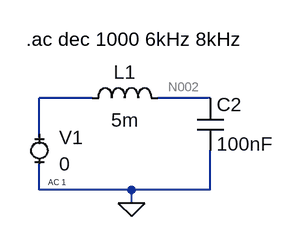
[diagram p0: schematic Draft1.asc]
Draft1.asc, the LTspice schematic file:
Version 4
SHEET 1 880 680
WIRE 144 96 80 96
WIRE 288 96 224 96
WIRE 80 144 80 96
WIRE 80 208 80 176
WIRE 192 208 80 208
WIRE 288 208 288 160
WIRE 288 208 192 208
WIRE 192 224 192 208
FLAG 192 224 0
SYMBOL MiniSyms4\\voltage- 80 160 R0
WINDOW 123 11 39 Left 0
WINDOW 39 0 0 Left 0
SYMATTR Value2 AC 1
SYMATTR InstName V1
SYMATTR Value 0
SYMBOL ind 128 112 R270
WINDOW 0 32 56 VTop 2
WINDOW 3 5 56 VBottom 2
SYMATTR InstName L1
SYMATTR Value 5m
SYMBOL cap 272 96 R0
SYMATTR InstName C2
SYMATTR Value 100nF
TEXT 64 24 Left 2 !.ac dec 1000 6kHz 8kHz

The netlist it stands for:
* Draft1.asc
V1 N001 0 0 AC 1
L1 N001 N002 5m
C2 N002 0 100nF
.ac dec 1000 6kHz 8kHz
.backanno
.end

* Results of the author's LTspice run, read from the files saved beside the schematic
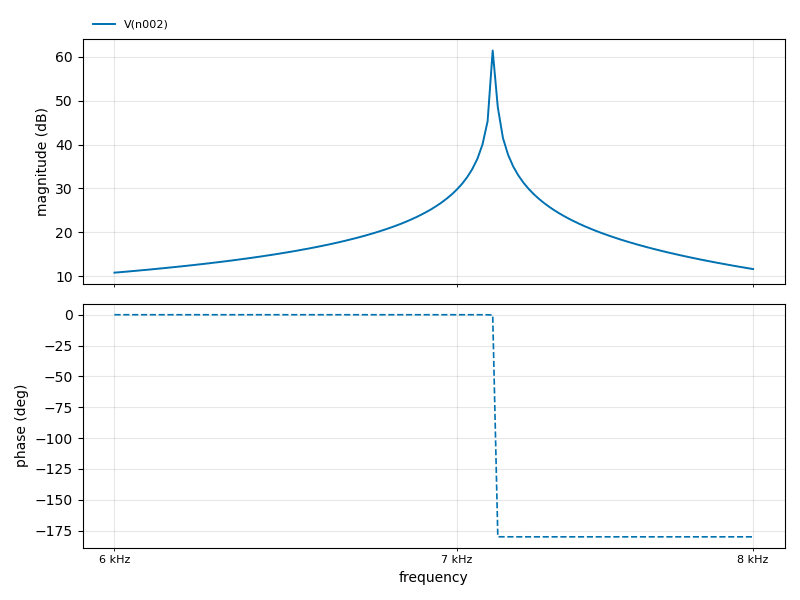
[diagram p1: AC Analysis of Draft1.asc, plotted from the saved traces]
* AC Analysis, 1 run:
*   V(n002): 10.77 dB at 6 kHz, 11.59 dB at 8 kHz, peak 61.45 dB at 7.115 kHz, 3 dB below the peak at 7.112 kHz and 7.118 kHz